# EAGLE schematic PowerDeliveryBoard (EAGLE 9.6.2)
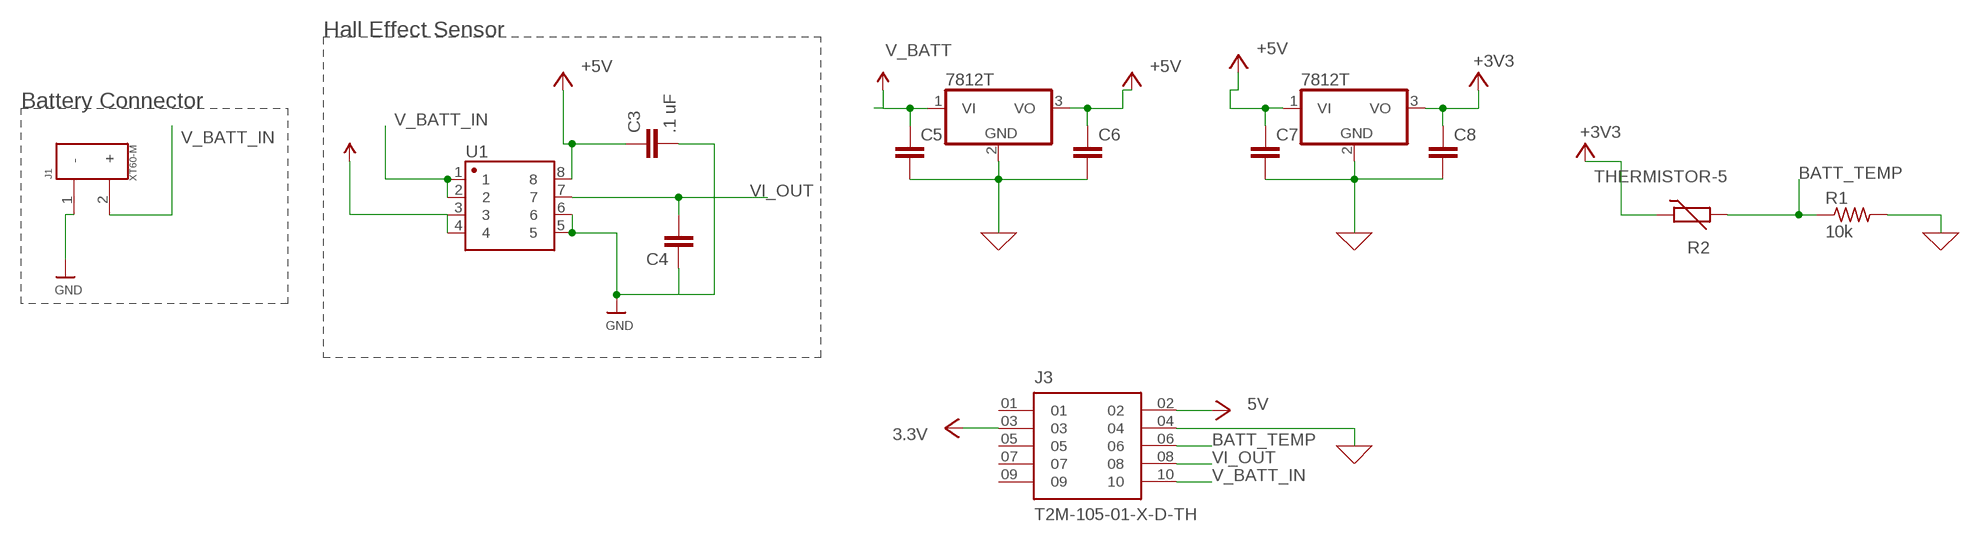
[diagram p0: schematic, sheet 1]

## Parts
C3  .1 uF  C2,5-3  [C2.5-3]
C4  C2,5-3  [C2.5-3]
C5  C2,5-3  [C2.5-3]
C6  C2,5-3  [C2.5-3]
C7  C2,5-3  [C2.5-3]
C8  C2,5-3  [C2.5-3]
IC1  7812T  [TO220H]
IC2  7812T  [TO220H]
J1  XT60-M  [AMASS_XT60-M]
J3  T2M-105-01-X-D-TH  [SAMTEC_T2M-105-01-X-D-TH]
R1  10k  R-US_0204/7  [0204/7]
R2  THERMISTOR-5  [R-5]
U1  GENERIC-SOIC8MSGEQ7N-FILTER  [SO08]

## Nets
0: C5.2 C6.2 C7.2 C8.2 IC1.2(GND) IC2.2(GND) J3.04 R1.2 ; supply symbol labelled GND
+3V3: C8.1 IC2.3(VO) R2.1
+5V: C3.1 C6.1 C7.1 IC1.3(VO) IC2.1(VI) U1.8
BATT_TEMP: J3.06 R1.1 R2.2
GND: C3.2 C4.1 J1.1(-) U1.5 U1.6
V_BATT: C5.1 IC1.1(VI) U1.3 U1.4
V_BATT_IN: J1.2(+) J3.10 U1.1 U1.2
VCC: J3.02 J3.03 ; supply symbol labelled 5V, 3.3V
VI_OUT: C4.2 J3.08 U1.7
Unconnected: J3.01 J3.05 J3.07 J3.09

## Notes on the sheet
- Hall Effect Sensor
- Battery Connector

## Library data of the parts
C3-C8 = capacitor-wima:C: CAPACITOR naming: grid - package width
IC1 IC2 = linear:78*: Positive VOLTAGE REGULATOR Source: http://cache.national.com/ds/LM/LM78L05.pdf http://www.fairchildsemi.com/ds/LM/LM7805.pdf
J1 = XT60-M:XT60-M: DC supply; XT60; male; PIN:2; for cable; soldered; 60A; 500V; AVAILABILITY: Unavailable; DESCRIPTION: Plug; DC supply; XT60; male; PIN: 2; for cable; soldered; 30A; 500V; MF: AMASS; MP: XT60-M; PACKAGE: Package; PRICE: None
J3 = T2M-105-01-X-D-TH:T2M-105-01-X-D-TH; MANUFACTURER: Samtec; MAXIMUM_PACKAGE_HEIGHT: 6.55mm; PARTREV: AH; STANDARD: Manufacturer Recommendations
R1 = rcl:R-US_: RESISTOR, American symbol; SPICEPREFIX: R
R2 = varistor:THERMISTOR: THERMISTOR
U1 = SparkFun-Retired:GENERIC-SOIC8: A placeholder for generic narrow & wide SOIC8 foorptints - used on the DIP adapter board. Has strange reference to IC-10141, a Seven Band Graphic Equalizer Display Filter SOIC-8 VFP: IC-10141; PROD_ID: IC-10141